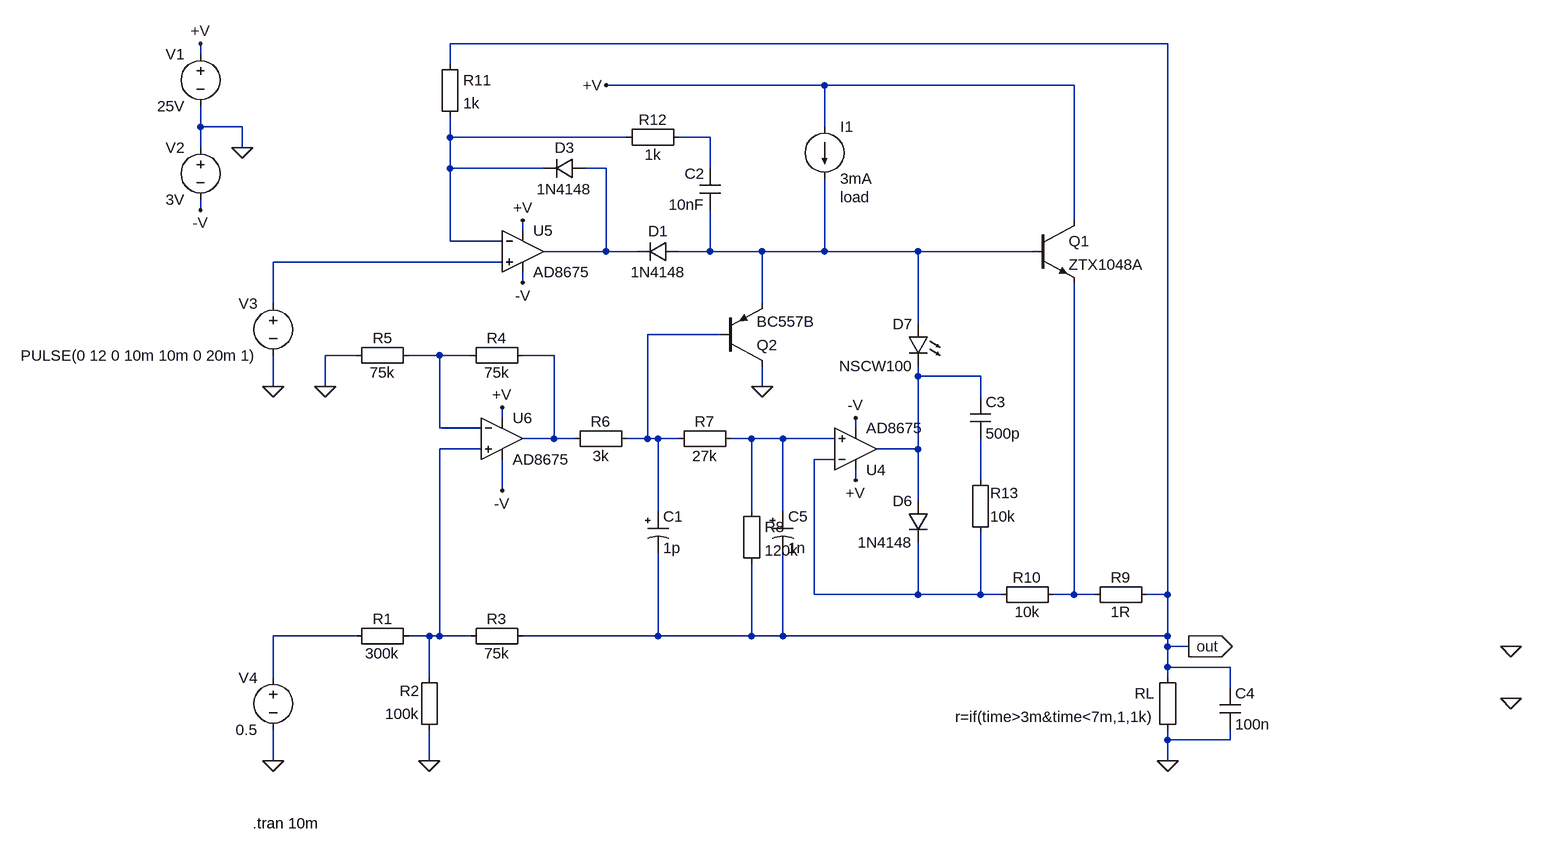
[diagram p0: schematic PSU CV CI high side I ref.asc]
PSU CV CI high side I ref.asc, the LTspice schematic file:
Version 4
SHEET 1 1812 1084
WIRE 1264 -208 160 -208
WIRE -224 -192 -224 -208
WIRE 160 -176 160 -208
WIRE 736 -144 400 -144
WIRE 1120 -144 736 -144
WIRE -224 -80 -224 -112
WIRE -160 -80 -224 -80
WIRE 736 -80 736 -144
WIRE 160 -64 160 -96
WIRE 432 -64 160 -64
WIRE 560 -64 512 -64
WIRE -224 -48 -224 -80
WIRE -160 -48 -160 -80
WIRE 160 -16 160 -64
WIRE 304 -16 160 -16
WIRE 400 -16 368 -16
WIRE 560 -16 560 -64
WIRE -224 48 -224 32
WIRE 1120 64 1120 -144
WIRE 272 80 272 64
WIRE 160 96 160 -16
WIRE 240 96 160 96
WIRE 400 112 400 -16
WIRE 400 112 304 112
WIRE 448 112 400 112
WIRE 560 112 560 48
WIRE 560 112 512 112
WIRE 640 112 560 112
WIRE 736 112 736 0
WIRE 736 112 640 112
WIRE 880 112 736 112
WIRE 1056 112 880 112
WIRE 240 128 -112 128
WIRE 272 160 272 144
WIRE -112 192 -112 128
WIRE 640 192 640 112
WIRE 880 224 880 112
WIRE 576 240 464 240
WIRE 16 272 -32 272
WIRE 144 272 96 272
WIRE 192 272 144 272
WIRE 320 272 272 272
WIRE 880 304 880 288
WIRE 976 304 880 304
WIRE -112 320 -112 272
WIRE -32 320 -32 272
WIRE 640 320 640 288
WIRE 976 336 976 304
WIRE 240 368 240 352
WIRE 144 384 144 272
WIRE 208 384 144 384
WIRE 784 384 784 368
WIRE 320 400 320 272
WIRE 320 400 272 400
WIRE 352 400 320 400
WIRE 464 400 464 240
WIRE 464 400 432 400
WIRE 480 400 464 400
WIRE 512 400 480 400
WIRE 624 400 592 400
WIRE 672 400 624 400
WIRE 752 400 672 400
WIRE 208 416 144 416
WIRE 880 416 880 304
WIRE 880 416 816 416
WIRE 752 432 720 432
WIRE 784 464 784 448
WIRE 976 464 976 400
WIRE 240 480 240 432
WIRE 880 496 880 416
WIRE 480 512 480 400
WIRE 624 512 624 400
WIRE 672 512 672 400
WIRE 720 640 720 432
WIRE 880 640 880 560
WIRE 880 640 720 640
WIRE 976 640 976 544
WIRE 976 640 880 640
WIRE 1008 640 976 640
WIRE 1120 640 1120 160
WIRE 1120 640 1088 640
WIRE 1152 640 1120 640
WIRE 1264 640 1264 -208
WIRE 1264 640 1232 640
WIRE 16 704 -112 704
WIRE 128 704 96 704
WIRE 144 704 144 416
WIRE 144 704 128 704
WIRE 192 704 144 704
WIRE 480 704 480 576
WIRE 480 704 272 704
WIRE 624 704 624 592
WIRE 624 704 480 704
WIRE 672 704 672 576
WIRE 672 704 624 704
WIRE 1264 704 1264 640
WIRE 1264 704 672 704
WIRE 1264 720 1264 704
WIRE 1296 720 1264 720
WIRE 1264 752 1264 720
WIRE 1360 752 1264 752
WIRE -112 768 -112 704
WIRE 128 768 128 704
WIRE 1264 768 1264 752
WIRE 1360 784 1360 752
WIRE 1264 864 1264 848
WIRE 1360 864 1360 848
WIRE 1360 864 1264 864
WIRE -112 896 -112 848
WIRE 128 896 128 848
WIRE 1264 896 1264 864
FLAG -160 -48 0
FLAG -224 -208 +V
FLAG 272 64 +V
FLAG 400 -144 +V
FLAG -112 320 0
FLAG 240 352 +V
FLAG -32 320 0
FLAG -112 896 0
FLAG 640 320 0
FLAG 784 464 +V
FLAG 1264 896 0
FLAG 128 896 0
FLAG -224 48 -V
FLAG 240 480 -V
FLAG 272 160 -V
FLAG 784 368 -V
FLAG 1296 720 out
IOPIN 1296 720 Out
FLAG 1792 720 0
FLAG 1792 800 0
SYMBOL npn 1056 64 R0
SYMATTR InstName Q1
SYMATTR Value ZTX1048A
SYMBOL voltage -224 -208 M0
WINDOW 123 0 0 Left 0
WINDOW 39 0 0 Left 0
SYMATTR InstName V1
SYMATTR Value 25V
SYMBOL Misc\\EuropeanResistor 1136 656 R270
WINDOW 0 27 56 VTop 2
WINDOW 3 5 56 VBottom 2
SYMATTR InstName R9
SYMATTR Value 1R
SYMBOL voltage -112 176 M0
WINDOW 123 0 0 Left 0
WINDOW 39 0 0 Left 0
SYMATTR InstName V3
SYMATTR Value PULSE(0 12 0 10m 10m 0 20m 1)
SYMBOL Misc\\EuropeanResistor 112 688 R90
WINDOW 0 5 56 VBottom 2
WINDOW 3 27 56 VTop 2
SYMATTR InstName R1
SYMATTR Value 300k
SYMBOL Misc\\EuropeanResistor 176 720 R270
WINDOW 0 27 56 VTop 2
WINDOW 3 5 56 VBottom 2
SYMATTR InstName R3
SYMATTR Value 75k
SYMBOL Misc\\EuropeanResistor 288 256 R90
WINDOW 0 5 56 VBottom 2
WINDOW 3 27 56 VTop 2
SYMATTR InstName R4
SYMATTR Value 75k
SYMBOL Misc\\EuropeanResistor 112 256 R90
WINDOW 0 5 56 VBottom 2
WINDOW 3 27 56 VTop 2
SYMATTR InstName R5
SYMATTR Value 75k
SYMBOL Misc\\EuropeanPolcap 464 512 R0
SYMATTR InstName C1
SYMATTR Value 1p
SYMATTR SpiceLine Rser=100m
SYMBOL voltage -112 752 M0
WINDOW 123 0 0 Left 0
WINDOW 39 0 0 Left 0
SYMATTR InstName V4
SYMATTR Value 0.5
SYMBOL Misc\\EuropeanResistor 336 416 R270
WINDOW 0 27 56 VTop 2
WINDOW 3 5 56 VBottom 2
SYMATTR InstName R6
SYMATTR Value 3k
SYMBOL Misc\\EuropeanResistor 608 384 R90
WINDOW 0 5 56 VBottom 2
WINDOW 3 27 56 VTop 2
SYMATTR InstName R7
SYMATTR Value 27k
SYMBOL Misc\\EuropeanResistor 608 496 R0
SYMATTR InstName R8
SYMATTR Value 120k
SYMBOL pnp 576 288 M180
WINDOW 0 56 32 Left 2
WINDOW 3 56 68 Left 2
SYMATTR InstName Q2
SYMATTR Value BC557B
SYMBOL diode 512 96 R90
WINDOW 0 0 32 VBottom 2
WINDOW 3 32 32 VTop 2
SYMATTR InstName D1
SYMATTR Value 1N4148
SYMBOL current 736 -80 R0
WINDOW 123 0 0 Left 0
WINDOW 39 24 108 Left 2
SYMATTR SpiceLine load
SYMATTR InstName I1
SYMATTR Value 3mA
SYMBOL Misc\\EuropeanResistor 1280 752 M0
SYMATTR InstName RL
SYMATTR Value r=if(time>3m&time<7m,1,1k)
SYMBOL Misc\\EuropeanResistor 144 864 R180
WINDOW 0 31 76 Left 2
WINDOW 3 31 40 Left 2
SYMATTR InstName R2
SYMATTR Value 100k
SYMBOL voltage -224 -64 M0
WINDOW 123 0 0 Left 0
WINDOW 39 0 0 Left 0
SYMATTR InstName V2
SYMATTR Value 3V
SYMBOL diode 368 -32 R90
WINDOW 0 0 32 VBottom 2
WINDOW 3 32 32 VTop 2
SYMATTR InstName D3
SYMATTR Value 1N4148
SYMBOL Misc\\EuropeanResistor 144 -192 R0
SYMATTR InstName R11
SYMATTR Value 1k
SYMBOL Misc\\EuropeanResistor 1104 624 R90
WINDOW 0 5 56 VBottom 2
WINDOW 3 27 56 VTop 2
SYMATTR InstName R10
SYMATTR Value 10k
SYMBOL cap 576 48 R180
WINDOW 0 24 56 Left 2
WINDOW 3 24 8 Left 2
SYMATTR InstName C2
SYMATTR Value 10nF
SYMBOL Misc\\EuropeanResistor 528 -80 R90
WINDOW 0 5 56 VBottom 2
WINDOW 3 27 56 VTop 2
SYMATTR InstName R12
SYMATTR Value 1k
SYMBOL cap 960 400 M180
WINDOW 0 24 56 Left 2
WINDOW 3 24 8 Left 2
SYMATTR InstName C3
SYMATTR Value 500p
SYMBOL Misc\\EuropeanResistor 960 560 M180
WINDOW 0 31 76 Left 2
WINDOW 3 31 40 Left 2
SYMATTR InstName R13
SYMATTR Value 10k
SYMBOL diode 896 496 M0
SYMATTR InstName D6
SYMATTR Value 1N4148
SYMBOL Opamps\\AD8675 784 480 M180
SYMATTR InstName U4
SYMBOL Opamps\\AD8675 272 48 R0
SYMATTR InstName U5
SYMBOL Opamps\\AD8675 240 336 R0
SYMATTR InstName U6
SYMBOL cap 1344 784 R0
SYMATTR InstName C4
SYMATTR Value 100n
SYMBOL Misc\\EuropeanPolcap 656 512 R0
SYMATTR InstName C5
SYMATTR Value 1n
SYMATTR SpiceLine Rser=100m
SYMBOL LED 896 224 M0
SYMATTR InstName D7
SYMATTR Value NSCW100
SYMATTR Description Diode
SYMATTR Type diode
TEXT -144 992 Left 2 !.tran 10m

The netlist it stands for:
* PSU CV CI high side I ref.asc
Q1 +V N004 N014 0 ZTX1048A
V1 +V 0 25V
R9 N014 out 1R
V3 N005 0 PULSE(0 12 0 10m 10m 0 20m 1)
R1 N011 N015 300k
R3 N011 out 75k
R4 N008 N007 75k
R5 N007 0 75k
C1 N006 out 1p Rser=100m
V4 N015 0 0.5
R6 N008 N006 3k
R7 N010 N006 27k
R8 N010 out 120k
Q2 0 N006 N004 0 BC557B
D1 N004 N003 1N4148
I1 +V N004 3mA load
RL out 0 r=if(time>3m&time<7m,1,1k)
R2 0 N011 100k
V2 0 -V 3V
D3 N003 N001 1N4148
R11 out N001 1k
R10 N014 N012 10k
C2 N004 N002 10nF
R12 N002 N001 1k
C3 N013 N009 500p
R13 N012 N013 10k
D6 N009 N012 1N4148
XU4 N010 N012 +V -V N009 AD8675  ; pins In+ In- V+ V- OUT
XU5 N005 N001 +V -V N003 AD8675  ; pins In+ In- V+ V- OUT
XU6 N011 N007 +V -V N008 AD8675  ; pins In+ In- V+ V- OUT
C4 out 0 100n
C5 N010 out 1n Rser=100m
D7 N004 N009 NSCW100
.model D D
.lib standard.dio
.model NPN NPN
.model PNP PNP
.lib standard.bjt
.tran 10m
.backanno
.end